# Altium schematic sheet Schematic.SchDoc
size 381 x 241 mm; SheetNumber: 1; SheetTotal: 1
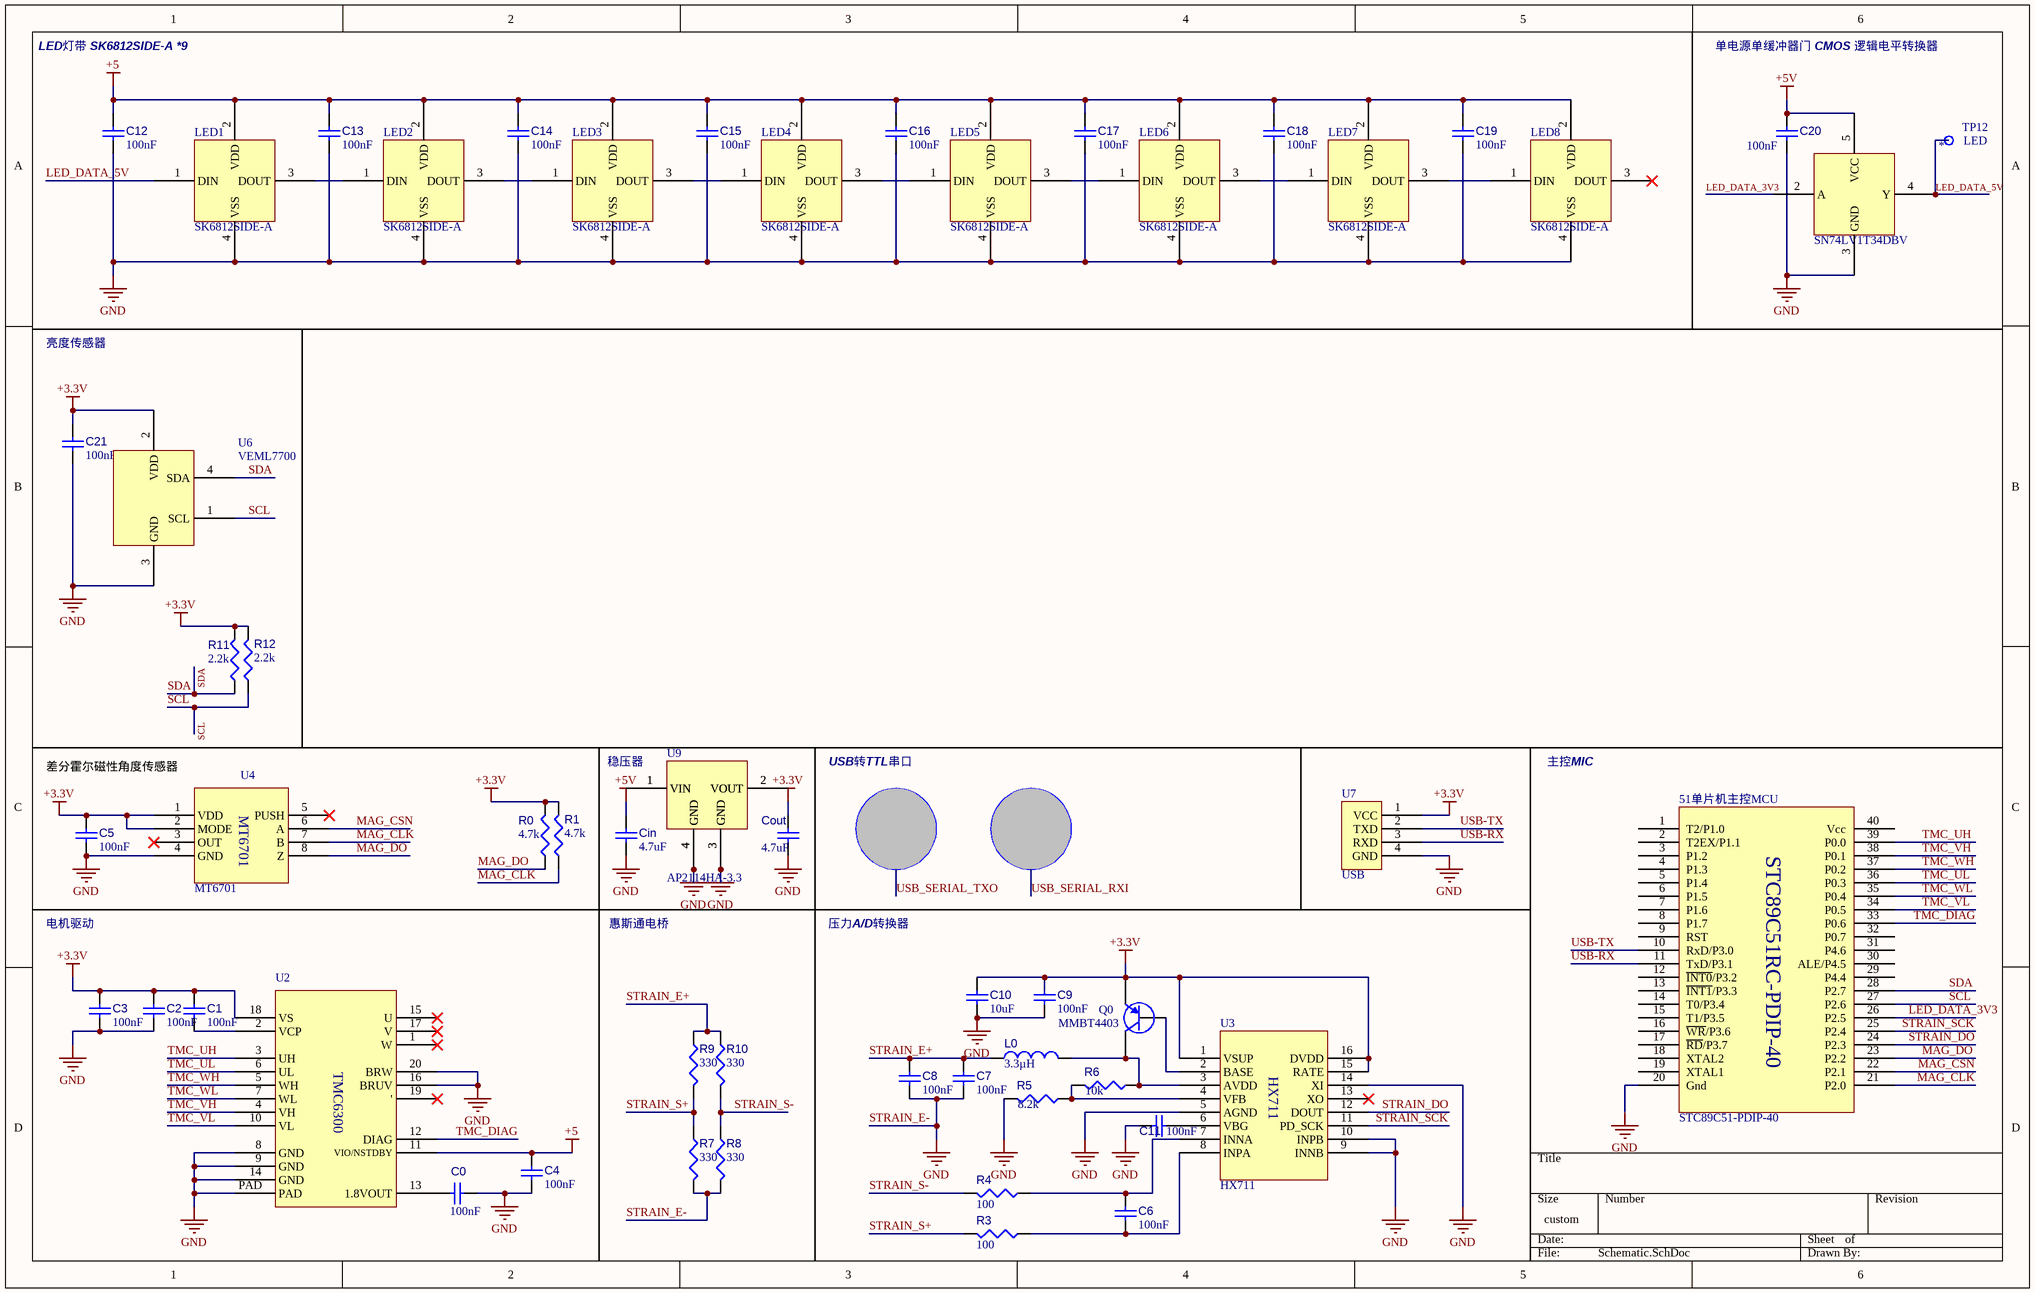
[diagram p0: Schematic.SchDoc]

## Parts
51单片机主控MCU  STC89C51-PDIP-40  [封装.STC89C51-PDIP-40]
*  SN74LV1T34DBV  [封装.SN74LV1T34DBVR]
C0  value 100nF  [CAPC1005X56X25LL10T15]  (hidden comment: Capacitor 0.1 uF +/- 5% 16 V 0402)
C1  value 100nF  [CAPC1005X56X25LL10T15]  (hidden comment: Capacitor 0.1 uF +/- 5% 16 V 0402)
C2  value 100nF  [CAPC1005X56X25LL10T15]  (hidden comment: Capacitor 0.1 uF +/- 5% 16 V 0402)
C3  value 100nF  [CAPC1005X56X25LL10T15]  (hidden comment: Capacitor 0.1 uF +/- 5% 16 V 0402)
C4  value 100nF  [CAPC1005X56X25LL10T15]  (hidden comment: Capacitor 0.1 uF +/- 5% 16 V 0402)
C5  value 100nF  [CAPC1005X56X25LL10T15]  (hidden comment: Capacitor 0.1 uF +/- 5% 16 V 0402)
C6  value 100nF  [CAPC1005X56X25LL10T15]  (hidden comment: Capacitor 0.1 uF +/- 5% 16 V 0402)
C7  value 100nF  [CAPC1005X56X25LL10T15]  (hidden comment: Capacitor 0.1 uF +/- 5% 16 V 0402)
C8  value 100nF  [CAPC1005X56X25LL10T15]  (hidden comment: Capacitor 0.1 uF +/- 5% 16 V 0402)
C9  value 100nF  [CAPC1005X56X25LL10T15]  (hidden comment: Capacitor 0.1 uF +/- 5% 16 V 0402)
C10  value 10uF  [CAPC1005X56X25LL10T15]  (hidden comment: Capacitor 0.1 uF +/- 5% 16 V 0402)
C11  value 100nF  [CAPC1005X56X25LL10T15]  (hidden comment: Capacitor 0.1 uF +/- 5% 16 V 0402)
C12  value 100nF  [CAPC1005X56X25LL10T15]  (hidden comment: Capacitor 0.1 uF +/- 5% 16 V 0402)
C13  value 100nF  [CAPC1005X56X25LL10T15]  (hidden comment: Capacitor 0.1 uF +/- 5% 16 V 0402)
C14  value 100nF  [CAPC1005X56X25LL10T15]  (hidden comment: Capacitor 0.1 uF +/- 5% 16 V 0402)
C15  value 100nF  [CAPC1005X56X25LL10T15]  (hidden comment: Capacitor 0.1 uF +/- 5% 16 V 0402)
C16  value 100nF  [CAPC1005X56X25LL10T15]  (hidden comment: Capacitor 0.1 uF +/- 5% 16 V 0402)
C17  value 100nF  [CAPC1005X56X25LL10T15]  (hidden comment: Capacitor 0.1 uF +/- 5% 16 V 0402)
C18  value 100nF  [CAPC1005X56X25LL10T15]  (hidden comment: Capacitor 0.1 uF +/- 5% 16 V 0402)
C19  value 100nF  [CAPC1005X56X25LL10T15]  (hidden comment: Capacitor 0.1 uF +/- 5% 16 V 0402)
C20  value 100nF  [CAPC1005X56X25LL10T15]  (hidden comment: Capacitor 0.1 uF +/- 5% 16 V 0402)
C21  value 100nF  [CAPC1005X56X25LL10T15]  (hidden comment: Capacitor 0.1 uF +/- 5% 16 V 0402)
Cin  value 4.7uF  [CAPC1005X56X25LL10T15]  (hidden comment: Capacitor 0.1 uF +/- 5% 16 V 0402)
Cout  value 4.7uF  [CAPC1005X56X25LL10T15]  (hidden comment: Capacitor 0.1 uF +/- 5% 16 V 0402)
L0  value 3.3µH  [INDC2520X120X60NL20T20]  (hidden comment: LQM2HPN1R0MJ0L)
LED1  SK6812SIDE-A
LED2  SK6812SIDE-A
LED3  SK6812SIDE-A
LED4  SK6812SIDE-A
LED5  SK6812SIDE-A
LED6  SK6812SIDE-A
LED7  SK6812SIDE-A
LED8  SK6812SIDE-A
Q0  MMBT4403  [UNIC-TO-92-3]
R0  value 4.7k  [RESC0402(1005)_L]  (hidden comment: 4D7KR2F)
R1  value 4.7k  [RESC0402(1005)_L]  (hidden comment: 4D7KR2F)
R3  value 100  [RESC0402(1005)_L]  (hidden comment: 4D7KR2F)
R4  value 100  [RESC0402(1005)_L]  (hidden comment: 4D7KR2F)
R5  value 8.2k  [RESC0402(1005)_L]  (hidden comment: 4D7KR2F)
R6  value 10k  [RESC0402(1005)_L]  (hidden comment: 4D7KR2F)
R7  value 330  [RESC0402(1005)_L]  (hidden comment: 4D7KR2F)
R8  value 330  [RESC0402(1005)_L]  (hidden comment: 4D7KR2F)
R9  value 330  [RESC0402(1005)_L]  (hidden comment: 4D7KR2F)
R10  value 330  [RESC0402(1005)_L]  (hidden comment: 4D7KR2F)
R11  value 2.2k  [RESC0402(1005)_L]  (hidden comment: 4D7KR2F)
R12  value 2.2k  [RESC0402(1005)_L]  (hidden comment: 4D7KR2F)
TMC1  U2
U3  HX711  [封装.HX711]
U4  MT6701
U6  VEML7700  [封装.VEML7700]
U7  USB
U9  AP2114HA-3.3  [封装.AP2114HA-3.3TRG1]

## Nets
+3.3V: C1.1 C2.1 C3.1 C5.1 C9.1 C10.1 C21.1 Cout.1 Q0.1(E) R0.2 R1.2 R11.2 R12.2 TMC1.18(VS) U3.1(VSUP) U3.15(RATE) U3.16(DVDD) U4.1(VDD) U4.2(MODE) U6.2(VDD) U7.1(VCC)
+5: C4.1 C12.1 C13.1 C14.1 C15.1 C16.1 C17.1 C18.1 C19.1 LED1.2(VDD) LED2.2(VDD) LED3.2(VDD) LED4.2(VDD) LED5.2(VDD) LED6.2(VDD) LED7.2(VDD) LED8.2(VDD) TMC1.11(VIO/NSTDBY)
+5V: *.5(VCC) C20.1 Cin.1
STRAIN_E-: 51单片机主控MCU.20(Gnd) *.3(GND) C0.1 C2.2 C3.2 C4.2 C5.2 C7.2 C8.2 C9.2 C10.2 C11.1 C12.2 C13.2 C14.2 C15.2 C16.2 C17.2 C18.2 C19.2 C20.2 C21.2 Cin.2 Cout.2 LED1.4(VSS) LED2.4(VSS) LED3.4(VSS) LED4.4(VSS) LED5.4(VSS) LED6.4(VSS) LED7.4(VSS) LED8.4(VSS) R5.2 R7.2 R8.2 TMC1.8(GND) TMC1.9(GND) TMC1.14(GND) TMC1.16(BRUV) TMC1.20(BRW) TMC1.PAD U3.5(AGND) U3.9(INNB) U3.10(INPB) U3.14(XI) U4.4(GND) U6.3(GND) U7.4(GND) U9.3(GND) U9.4(GND)  [also labelled GND]
LED_DATA_3V3: 51单片机主控MCU.26(P2.5) *.2(A)
LED_DATA_5V: *.4(Y) LED1.1(DIN)
MAG_CLK: 51单片机主控MCU.21(P2.0) R1.1 U4.7(B)
MAG_CSN: 51单片机主控MCU.22(P2.1) U4.6(A)
MAG_DO: 51单片机主控MCU.23(P2.2) R0.1 U4.8(Z)
SCL: 51单片机主控MCU.27(P2.6) R12.1 U6.1(SCL)
SDA: 51单片机主控MCU.28(P2.7) R11.1 U6.4(SDA)
STRAIN_DO: 51单片机主控MCU.24(P2.3) U3.12(DOUT)
STRAIN_E+: C7.1 C8.1 L0.1 R9.1 R10.1
STRAIN_S+: R3.2 R7.1 R9.2
STRAIN_S-: R4.2 R8.1 R10.2
STRAIN_SCK: 51单片机主控MCU.25(P2.4) U3.11(PD_SCK)
TMC_DIAG: 51单片机主控MCU.33(P0.6) TMC1.12(DIAG)
TMC_UH: 51单片机主控MCU.39(P0.0) TMC1.3(UH)
TMC_UL: 51单片机主控MCU.36(P0.3) TMC1.6(UL)
TMC_VH: 51单片机主控MCU.38(P0.1) TMC1.4(VH)
TMC_VL: 51单片机主控MCU.34(P0.5) TMC1.10(VL)
TMC_WH: 51单片机主控MCU.37(P0.2) TMC1.5(WH)
TMC_WL: 51单片机主控MCU.35(P0.4) TMC1.7(WL)
USB-RX: 51单片机主控MCU.11(TxD/P3.1) U7.3(RXD)
USB-TX: 51单片机主控MCU.10(RxD/P3.0) U7.2(TXD)
NetC0_2: C0.2 TMC1.13(1.8VOUT)
NetC1_2: C1.2 TMC1.2(VCP)
NetC6_1: C6.1 R4.1 U3.7(INNA)
NetC6_2: C6.2 R3.1 U3.8(INPA)
NetC11_2: C11.2 U3.6(VBG)
NetL0_2: L0.2 Q0.3(C) R6.1 U3.3(AVDD)
NetLED1_3: LED1.3(DOUT) LED2.1(DIN)
NetLED2_3: LED2.3(DOUT) LED3.1(DIN)
NetLED3_3: LED3.3(DOUT) LED4.1(DIN)
NetLED4_3: LED4.3(DOUT) LED5.1(DIN)
NetLED5_3: LED5.3(DOUT) LED6.1(DIN)
NetLED6_3: LED6.3(DOUT) LED7.1(DIN)
NetLED7_3: LED7.3(DOUT) LED8.1(DIN)
NetQ0_2: Q0.2(B) U3.2(BASE)
NetR5_1: R5.1 R6.2 U3.4(VFB)

Not connected (* = marked no-connect by the designer): 51单片机主控MCU 1(T2/P1.0) 2(T2EX/P1.1) 3(P1.2) 4(P1.3) 5(P1.4) 6(P1.5) 7(P1.6) 8(P1.7) 9(RST) 12(~{INT0}/P3.2) 13(~{INT1}/P3.3) 14(T0/P3.4) 15(T1/P3.5) 16(~{WR}/P3.6) 17(~{RD}/P3.7) 18(XTAL2) 19(XTAL1) 29(P4.4) 30(ALE/P4.5) 31(P4.6) 32(P0.7) 40(Vcc); LED8 3(DOUT)*; TMC1 1(W)* 15(U)* 17(V)* 19(')*; U3 13(XO)*; U4 3(OUT)* 5(PUSH)*; U9 1(VIN) 2(VOUT)

## Notes on the sheet
- LED灯带 SK6812SIDE-A *9
- 单电源单缓冲器门 CMOS 逻辑电平转换器
- TP12
- LED
- 亮度传感器
- 差分霍尔磁性角度传感器
- (near U9) 稳压器
- USB转TTL串口
- 主控MIC
- 电机驱动
- 惠斯通电桥
- 压力A/D转换器
- (in symbol CMP-007-000098-1) STC89C51RC-PDIP-40

## Library data of the parts
51单片机主控MCU = CMP-007-000098-1: 主控MCU; Source: IC.SchLib; Design Item ID: STC89C51-PDIP-40
* = CMP-007-000097-1: 电流放大器; Design Item ID: SN74LV1T34DBV; Source: IC.SchLib
C0-C21 Cin Cout = CAP-NP-2: Chip Capacitor, 0.1 uF, +/- 5%, 16 V, 0402 (1005 Metric); Capacitor Type: Ceramic; Voltage Rating: 16V; Max Operating Temperature: 125°C; Min Operating Temperature: -55°C; Case/Package: 0402; Mounting Technology: SM; Pins: 2; Tolerance: 5%; RoHS Compliant: True
L0 = CMP-006-00008-6: Chip Inductor, 1 uH, +/- 20%, 1 MHz, -55 to 125 degC, 1008 (2520 Metric), RoHS, Tape and Reel; Manufacturer: Murata; Self Resonant Frequency: 70MHz; Current Rating: 1.5A; Shielding: Shielded; Core Material: Ferrite; Resistance: 0.09Ohm; Datasheet URL: http://psearch.en.murata.com/inductor/product/LQM2HPN1R0MJ0%23.pdf; Datasheet Version: Aug-16; RoHS Compliant: True; Case/Package: 1008; Package Description: 2-Pin Surface Mount Device, Body 2.5 x 2 mm; Package Quantity: 3000; Tolerance: 20%; Min Operating Temperature: -40°C; Package Reference: 1008; Packaging: TapeandReel; Mounting Technology: SM; Max Operating Temperature: 85°C
LED1-LED8 = CMP-007-000012-1: Design Item ID: SK6812SIDE-A; Source: IC.SchLib
Q0 = CMP-013-00004-3: Low Voltage High Current Small Signal PNP Transistor, 20 V, 700 mA, 3-Pin TO-92, RoHS; Manufacturer: Unisonic; Mounting Technology: TH; Package Description: 3-Pin Through Hole Device, Dia 4.58 mm, Pitch 1.27 mm; Datasheet URL: http://media.nkcelectronics.com/datasheet/s8550.pdf; Case/Package: TO-92-3; Datasheet Version: Rev. E, 06/2014; Package Reference: TO-92-3; RoHS Compliant: Unknown
R0 R1 R3-R12 = CMP-009-00105-2: 4K7 0.063W 1% 0402 (1005 Metric)  SMD; Power: 63mW; Mounting Technology: SMT; Case/Package: 0402; Tolerance: 1%; Pins: 2
TMC1 = CMP-007-000000-1: Source: IC.SchLib; Design Item ID: TMC6300
U3 = CMP-007-000093-1: 压力模数转换器; Source: IC.SchLib; Design Item ID: HX711
U4 = CMP-007-000002-1: Source: IC.SchLib; Design Item ID: MT6701
U6 = CMP-007-000095-1: 感光想读传感器; Design Item ID: VEML7700; Source: IC.SchLib
U7 = CMP-007-000053-1: Source: IC.SchLib; Design Item ID: USB
U9 = CMP-007-000082-1: 电压控制器; Design Item ID: AP2114HA-3.3; Source: IC.SchLib